# EAGLE design Clone (EAGLE 6.6.0)
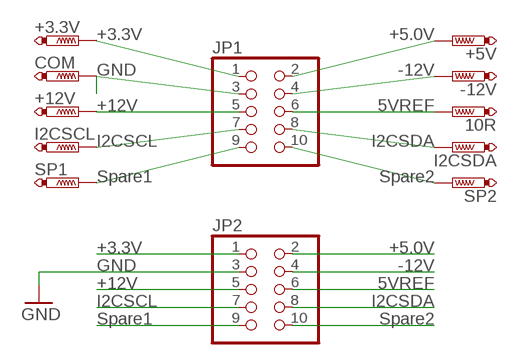
[diagram p0: schematic, sheet 1]

## Parts
10R  PTR1B1,27  [B1,27]
+3.3V  PTR1B1,27  [B1,27]
+5V  PTR1B1,27  [B1,27]
+12V  PTR1B1,27  [B1,27]
-12V  PTR1B1,27  [B1,27]
COM  PTR1B1,27  [B1,27]
I2CSCL  PTR1B1,27  [B1,27]
I2CSDA  PTR1B1,27  [B1,27]
JP1  PINHD-2X5/90  [2X05/90]
JP2  PINHD-2X5/90  [2X05/90]
SP1  PTR1B1,27  [B1,27]
SP2  PTR1B1,27  [B1,27]

## Nets
5VREF: 10R.TP JP1.6 JP2.6
+3.3V: +3.3V.TP JP1.1 JP2.1
+5.0V: +5V.TP JP1.2 JP2.2
+12V: +12V.TP JP1.5 JP2.5
-12V: -12V.TP JP1.4 JP2.4
GND: COM.TP JP1.3 JP2.3
I2CSCL: I2CSCL.TP JP1.7 JP2.7
I2CSDA: I2CSDA.TP JP1.8 JP2.8
SPARE1: JP1.9 JP2.9 SP1.TP
SPARE2: JP1.10 JP2.10 SP2.TP

## Notes on the sheet
- +3.3V | +5.0V
- GND | -12V
- +12V | 5VREF
- I2CSCL | I2CSDA
- Spare1 | Spare2
- +3.3V | +5.0V
- GND | -12V
- +12V | 5VREF
- I2CSCL | I2CSDA
- Spare1 | Spare2

## Library data of the parts
10R +3.3V +5V +12V -12V COM I2CSCL I2CSDA SP1 SP2 = testpad:PTR1: TEST PIN
JP1 JP2 = pinhead+:PINHD-2X5: PIN HEADER

## Board
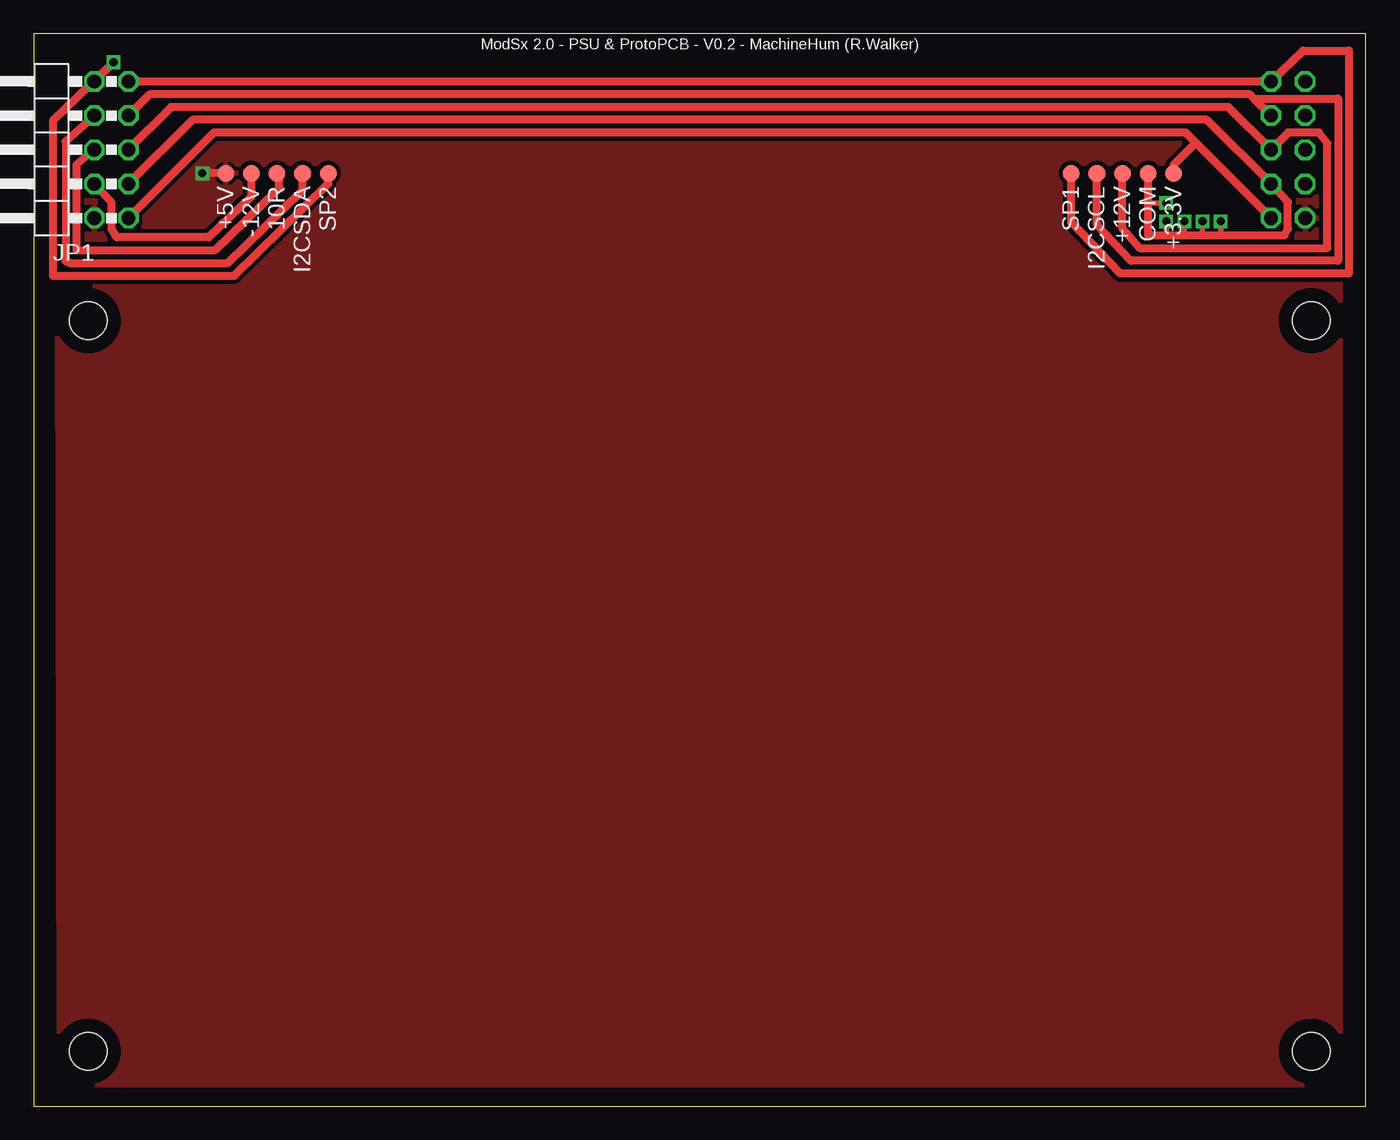
[diagram p1: board, top side]
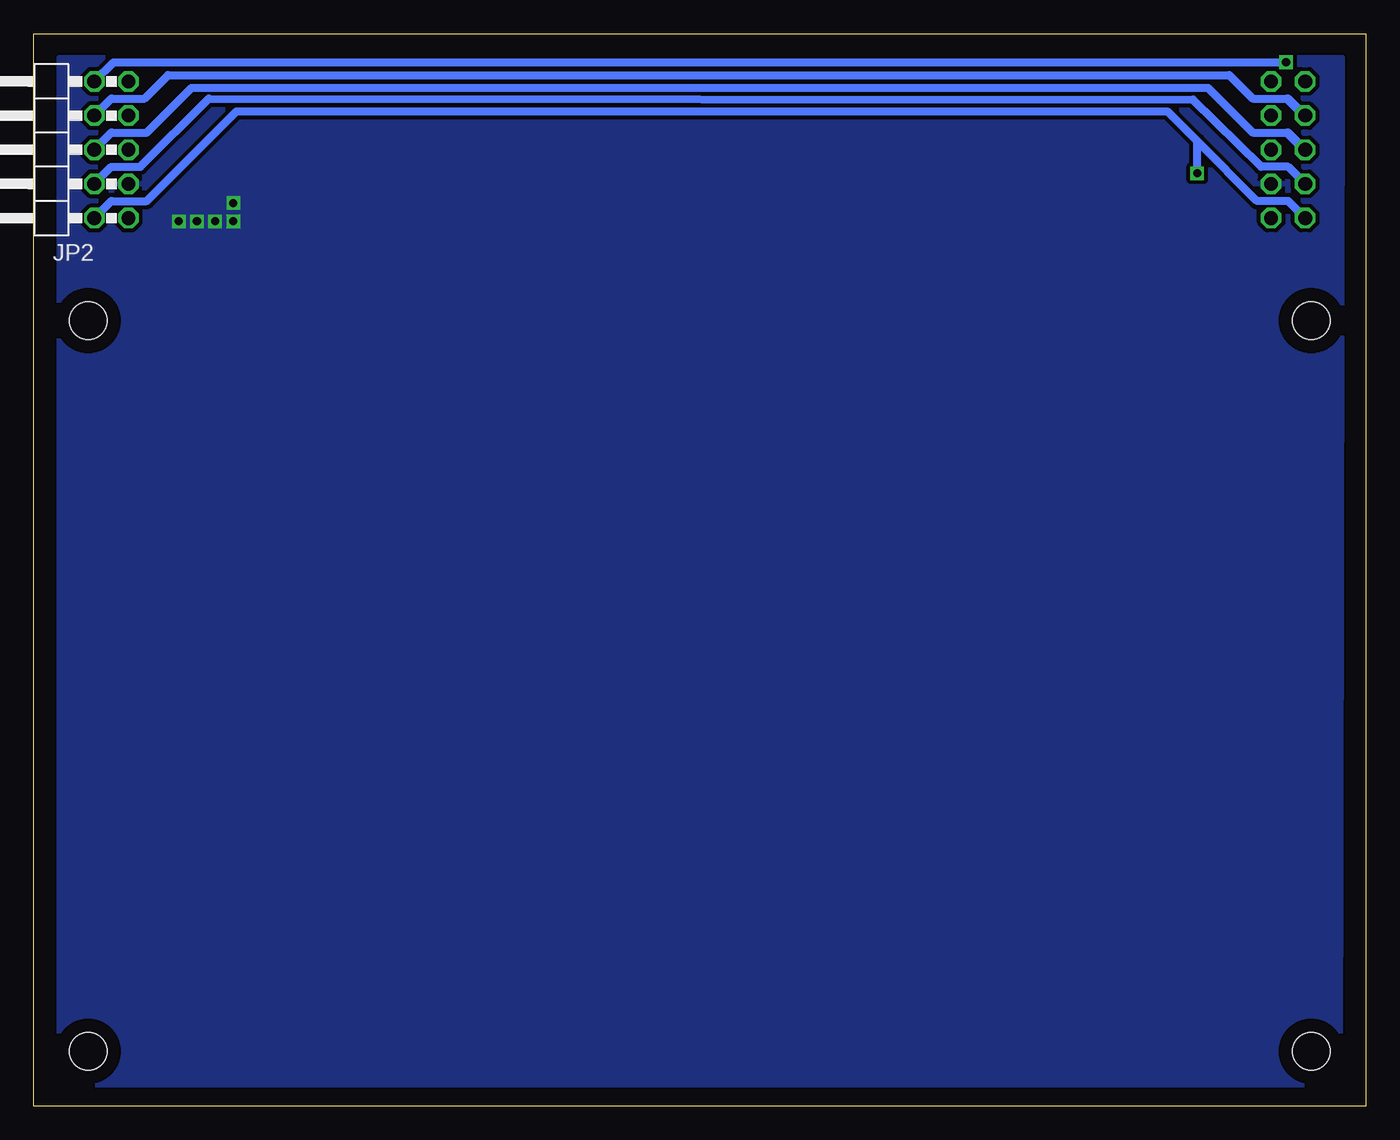
[diagram p2: board, bottom side, seen from below]

Size 99.06 x 79.76 mm. Coordinates in mm from the lower left corner, seen from the top.
Outline: 0,0 99.06,0 99.06,79.76 0,79.76 0,0
Copper layers (1*16): Top 0.035mm / dielectric 1.5mm / Bottom 0.035mm
Design rules "default": minimum track width 10mil, minimum drill 24mil, track to track 8mil, track to pad 8mil, pad to pad 8mil, via to via 8mil, smd to smd 8mil, copper to edge 40mil, drill to drill 8mil, minimum pad ring 10mil, minimum via ring 8mil, stop-mask expansion 4mil, vias tented up to drill 0mil, thermal gap 10mil
Holes 2.8 mm at 4.06,58.42 95,58.42 4.06,4.06 95,4.06

### Footprints (pad centres in the part's own frame; a part is rotated, then mirrored left to right if it is on the bottom)
B1,27 = smd 1.27 x 1.27: TP 0,0
2X05/90 = drill 1.016 octagon: 1 -5.08,-6.35; 2 -5.08,-3.81; 3 -2.54,-6.35; 4 -2.54,-3.81; 5 0,-6.35; 6 0,-3.81; 7 2.54,-6.35; 8 2.54,-3.81; 9 5.08,-6.35; 10 5.08,-3.81

### Placement (x,y rotation side)
10R  18.1,69.37 270 top
+3.3V  84.77,69.37 270 top
+5V  14.29,69.37 270 top
+12V  80.96,69.37 270 top
-12V  16.19,69.37 270 top
COM  82.87,69.37 270 top
I2CSCL  79.06,69.37 270 top
I2CSDA  20,69.37 270 top
JP1  0.7,71.12 90 top
JP2  98.36,71.12 90 bottom
SP1  77.15,69.37 270 top
SP2  21.91,69.37 270 top

### Tracks (layer width: path | path; a pad name or v marks a point on that pad's centre or on a via)
5VREF
  Top 0.61: 10R.TP 18.26,69.22 18.26,68.26 13.49,63.66 3.17,63.66 3.17,70.01 JP1.6
  Bottom 0.61: JP1.6 5.78,72.39 5.87,72.39 | JP2.6 93.28,72.39 90.65,72.39 87.31,75.72 11.75,75.72 8.41,72.39 5.87,72.39 | 5.87,72.39 4.6,71.12
+3.3V
  Top 0.61: JP1.1 13.4,72.39 85.66,72.39 86.41,71.64 | JP2.1 86.41,71.64 | +3.3V.TP 84.77,70.01 86.41,71.64
+5.0V  (via drill 0.6)
  Top 0.61: +5V.TP v12.54,69.37
  Bottom 0.61: JP1.2 5.78,67.31 8.1,67.31 12.54,71.75 | JP2.2 93.28,67.31 90.65,67.31 83.98,73.98 14.76,73.98 12.54,71.75 | v12.54,69.37 12.54,71.75
  pour Top (isolate 0.305): 1.91,1.59 1.91,4.45 1.75,77.95 97.16,77.95 97.16,1.59
+12V
  Top 0.61: JP1.5 10.22,74.3 88.84,74.3 JP2.5 93.28,72.39 95.57,72.39 96.2,71.6 96.2,63.82 82.23,63.82 80.96,65.25 +12V.TP
-12V
  Top 0.61: -12V.TP 16.19,67.63 13.02,64.61 6.19,64.61 5.79,65.25 5.79,67.22 JP1.4
  Bottom 0.61: JP1.4 5.78,69.85 7.78,69.85 12.86,74.85 86.04,74.93 91.12,69.85 93.28,69.85 JP2.4
GND  (via drill 0.6)
  Top 0.406: v84.22,65.8 84.22,64.77 | v85.57,65.8 85.57,64.85 | v86.92,65.8 86.92,64.93 | v88.27,65.8 88.27,64.93 | v84.22,67.15 82.95,67.15
  Top 0.61: JP1.3 11.81,73.34 87.25,73.34 JP2.3 93.27,67.25 93.27,65.25 93.03,64.77 84.22,64.77 82.87,64.77 COM.TP
  pour Bottom (isolate 0.305): 1.91,1.59 1.75,77.95 97.16,77.95 97.16,1.59
I2CSCL
  Top 0.61: JP1.7 8.64,75.25 90.42,75.25 90.74,74.93 | JP2.7 90.74,74.93 | 90.74,74.93 97,74.93 97,62.87 81.6,62.87 79.06,65.56 I2CSCL.TP
I2CSDA
  Top 0.61: I2CSDA.TP 20,68.1 14.45,62.71 2.7,62.71 2.38,62.87 2.38,71.75 JP1.8
  Bottom 0.61: JP1.8 5.78,74.93 5.87,74.93 | JP2.8 93.28,74.93 90.81,74.93 89.06,76.68 10.16,76.68 8.41,74.93 5.87,74.93 | 5.87,74.93 4.6,73.66
SPARE1
  Top 0.61: JP1.9 JP2.9 94.39,78.5 97.79,78.5 97.79,61.91 80.8,61.91 77.15,65.72 SP1.TP
SPARE2  (via drill 0.6)
  Top 0.61: SP2.TP 21.91,68.58 14.92,61.75 1.43,61.75 1.43,73.28 v5.94,77.63 JP1.10
  Bottom 0.61: JP2.10 93.12,77.63 v5.94,77.63

### Text on the board
tPlace: ModSx 2.0 - PSU & ProtoPCB - V0.2 - MachineHum (R.Walker)